# Altium project cps_tc_pishield.PrjPcb
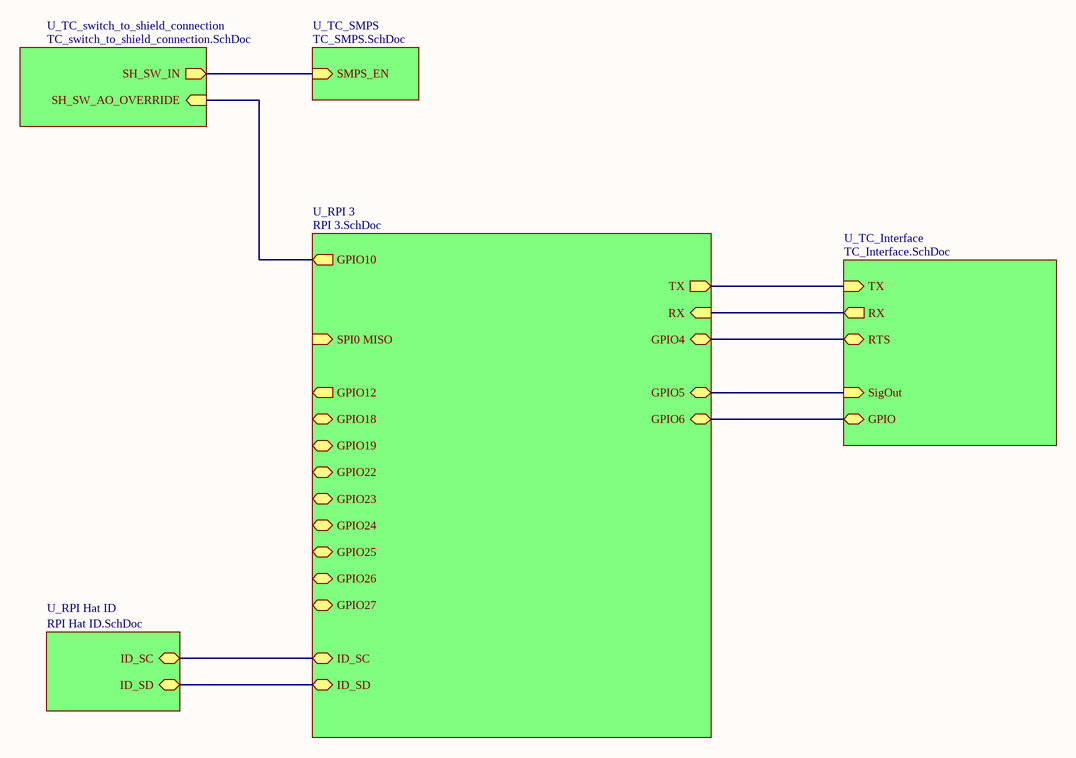
[diagram p0: cps_tc_pishield.SchDoc]
6 sheets, 32 parts. Net scope: hierarchical (ports join the sheet entries above them; power ports are global).
Board file: cps_tc_pishield.PcbDoc
Sheets:
  cps_tc_pishield.SchDoc
    U_RPI 3 = RPI 3.SchDoc
    U_RPI Hat ID = RPI Hat ID.SchDoc
    U_TC_Interface = TC_Interface.SchDoc
    U_TC_SMPS = TC_SMPS.SchDoc
    U_TC_switch_to_shield_connection = TC_switch_to_shield_connection.SchDoc

## Sheet cps_tc_pishield.SchDoc
size A4

### Sub-sheets
U_RPI 3 = RPI 3.SchDoc: GPIO4 (bidir), GPIO27 (bidir), GPIO22 (bidir), GPIO26 (bidir), GPIO19 (bidir), GPIO6 (bidir), GPIO5 (bidir), RX (in), TX (out), GPIO24 (bidir), GPIO25 (bidir), GPIO12 (out), GPIO18 (bidir), GPIO23 (bidir), ID_SC (bidir), ID_SD (bidir), SPI0 MISO (in), GPIO10 (out)
U_RPI Hat ID = RPI Hat ID.SchDoc: ID_SC (bidir), ID_SD (bidir)
U_TC_Interface = TC_Interface.SchDoc: GPIO (bidir), RTS (bidir), TX (in), RX (out), SigOut (in)
U_TC_SMPS = TC_SMPS.SchDoc: SMPS_EN (in)
U_TC_switch_to_shield_connection = TC_switch_to_shield_connection.SchDoc: SH_SW_AO_OVERRIDE (in), SH_SW_IN (out)

### Nets
EN: sheet U_TC_SMPS/SMPS_EN, sheet U_TC_switch_to_shield_connection/SH_SW_IN
GPIO0: sheet U_RPI 3/GPIO6, sheet U_TC_Interface/GPIO
RTS: sheet U_RPI 3/GPIO4, sheet U_TC_Interface/RTS
RX: sheet U_RPI 3/RX, sheet U_TC_Interface/RX
SigOut: sheet U_RPI 3/GPIO5, sheet U_TC_Interface/SigOut
TX: sheet U_RPI 3/TX, sheet U_TC_Interface/TX
NetJ3_1: sheet U_RPI 3/GPIO10, sheet U_TC_switch_to_shield_connection/SH_SW_AO_OVERRIDE
NetR4_1: sheet U_RPI 3/ID_SD, sheet U_RPI Hat ID/ID_SD
NetR5_1: sheet U_RPI 3/ID_SC, sheet U_RPI Hat ID/ID_SC

## Sheet RPI 3.SchDoc
size A4; SheetNumber: 1; SheetTotal: 1
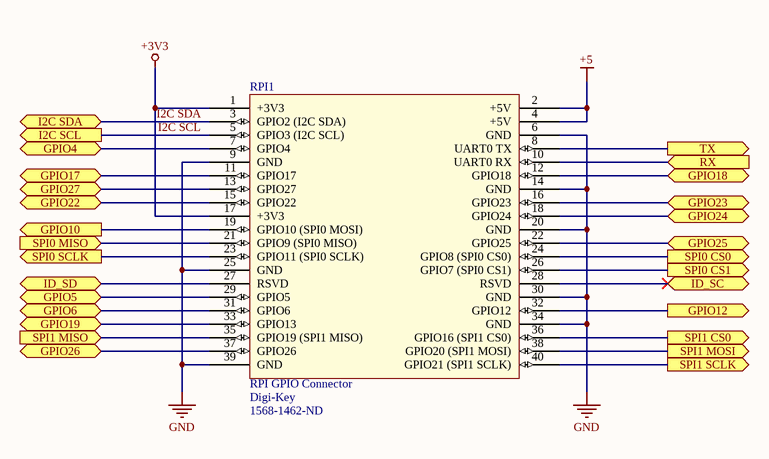
[diagram p1: RPI 3.SchDoc]

### Parts
RPI1  RPI GPIO Connector  Supplier 1: Digi-Key  Supplier Part Number 1: 1568-1462-ND  [rpi]

### Ports
GPIO4 (bidir), GPIO5 (bidir), GPIO6 (bidir), GPIO10 (out), GPIO12 (out), GPIO17 (bidir), GPIO18 (bidir), GPIO19 (bidir), GPIO22 (bidir), GPIO23 (bidir), GPIO24 (bidir), GPIO25 (bidir), GPIO26 (bidir), GPIO27 (bidir), I2C SCL (out), I2C SDA (bidir), ID_SC (bidir), ID_SD (bidir), RX (in), SPI0 CS0 (out), SPI0 CS1 (out), SPI0 MISO (in), SPI0 SCLK (out), SPI1 CS0 (out), SPI1 MISO (in), SPI1 MOSI (out), SPI1 SCLK (out), TX (out)

### Nets
+3V3: RPI1.1(+3V3) RPI1.17(+3V3)
+5: RPI1.2(+5V) RPI1.4(+5V)
GND: RPI1.6(GND) RPI1.9(GND) RPI1.14(GND) RPI1.20(GND) RPI1.25(GND) RPI1.30(GND) RPI1.34(GND) RPI1.39(GND)
GPIO0: RPI1.31(GPIO6) ; port GPIO6
I2C SCL: RPI1.5(GPIO3_(I2C_SCL)) ; port I2C SCL
I2C SDA: RPI1.3(GPIO2_(I2C_SDA)) ; port I2C SDA
RTS: RPI1.7(GPIO4) ; port GPIO4
RX: RPI1.10(UART0_RX) ; port RX
SigOut: RPI1.29(GPIO5) ; port GPIO5
TX: RPI1.8(UART0_TX) ; port TX
NetJ3_1: RPI1.19(GPIO10_(SPI0_MOSI)) ; port GPIO10
NetR4_1: RPI1.27(RSVD) ; port ID_SD
NetR5_1: RPI1.28(RSVD) ; port ID_SC
NetRPI1_11: RPI1.11(GPIO17) ; port GPIO17
NetRPI1_12: RPI1.12(GPIO18) ; port GPIO18
NetRPI1_13: RPI1.13(GPIO27) ; port GPIO27
NetRPI1_15: RPI1.15(GPIO22) ; port GPIO22
NetRPI1_16: RPI1.16(GPIO23) ; port GPIO23
NetRPI1_18: RPI1.18(GPIO24) ; port GPIO24
NetRPI1_21: RPI1.21(GPIO9_(SPI0_MISO)) ; port SPI0 MISO
NetRPI1_22: RPI1.22(GPIO25) ; port GPIO25
NetRPI1_23: RPI1.23(GPIO11_(SPI0_SCLK)) ; port SPI0 SCLK
NetRPI1_24: RPI1.24(GPIO8_(SPI0_CS0)) ; port SPI0 CS0
NetRPI1_26: RPI1.26(GPIO7_(SPI0_CS1)) ; port SPI0 CS1
NetRPI1_32: RPI1.32(GPIO12) ; port GPIO12
NetRPI1_33: RPI1.33(GPIO13) ; port GPIO19
NetRPI1_35: RPI1.35(GPIO19_(SPI1_MISO)) ; port SPI1 MISO
NetRPI1_36: RPI1.36(GPIO16_(SPI1_CS0)) ; port SPI1 CS0
NetRPI1_37: RPI1.37(GPIO26) ; port GPIO26
NetRPI1_38: RPI1.38(GPIO20_(SPI1_MOSI)) ; port SPI1 MOSI
NetRPI1_40: RPI1.40(GPIO21_(SPI1_SCLK)) ; port SPI1 SCLK

### Library data of the parts
RPI1 = rpi connector: GPIO Header for Raspberry Pi A+/B+/Pi 2/Pi 3 - 2x20; Manufacturer: SparkFun Electronics; Manufacturer Part Number: PRT-14017; Nils Minor: author; nilsminor@web.de: mail; RoHS: RoHS Compliant; Category: Development Boards, Kits, Programmers; Stock 1: 150; Pricing 1: 1=1.84 (EUR); Part Status: Active; Accessory Type: Connector; For Use With/Related Products: Raspberry Pi; ComponentLink1URL: https://cdn.sparkfun.com/datasheets/Dev/RaspberryPi/12313.pdf; ComponentLink1Description: https://cdn.sparkfun.com/datasheets/Dev/RaspberryPi/12313.pdf

## Sheet RPI Hat ID.SchDoc
size A4
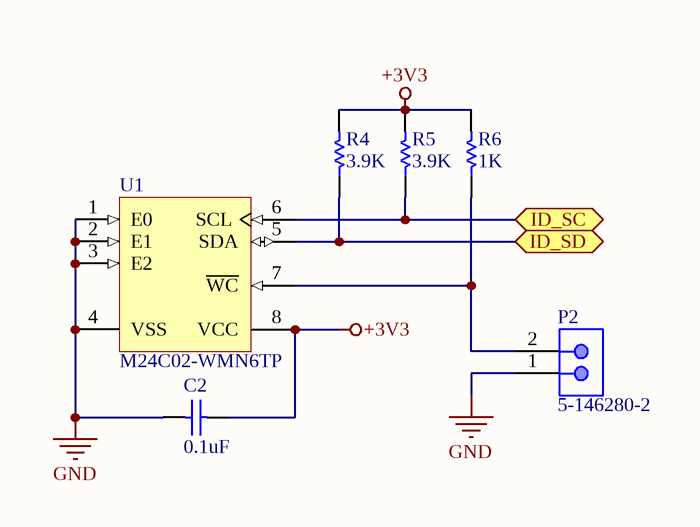
[diagram p2: RPI Hat ID.SchDoc]

### Parts
C2  0.1uF  [CAPC1608X87X35NL15T15]
P2  5-146280-2  [TECO-5-146280-2_V]
R4  3.9K  [RESC1608X55X30ML15T15]
R5  3.9K  [RESC1608X55X30ML15T15]
R6  1K  [RESC1608X55X30ML15T15]
U1  M24C02-WMN6TP  [STM-M24C02-WMN6TP-8_M]

### Ports
ID_SC (bidir), ID_SD (bidir)

### Nets
+3V3: C2.1 R4.2 R5.2 R6.2 U1.8(VCC)
GND: C2.2 P2.1 U1.1(E0) U1.2(E1) U1.3(E2) U1.4(VSS)
NetP2_2: P2.2 R6.1 U1.7(~{WC})
NetR4_1: R4.1 U1.5(SDA) ; port ID_SD
NetR5_1: R5.1 U1.6(SCL) ; port ID_SC

### Library data of the parts
C2 = CMP-2006-03300-1: Part Number: C0603X104K5RACTU; Manufacturer: Kemet
P2 = CMP-2000-07492-1: Male Header, Pitch 2.54 mm, 1 x 2 Position, Height 8.21 mm, Tail Length 3.05 mm, -65 to 105 degC, RoHS, Bulk; Manufacturer: TE Connectivity; Mating Connector Lock: No(Without); Number of Positions: 2; Pitch: 2.54mm; PCB Mounting Orientation: Vertical; Keyed: No; Case\/Package: 100; Mating Post Length: 0.23inch; High Temperature Housing: Yes; Max Current Rating: 5A; PCB Thickness: 0.063inch; PCB Mount Retention: Without; Approvals: CSA; Current Rating: 3A; Radiation Hardening: No; Length: 4.67mm; Contact Mating Length: 0.23inch; Connector Type: Header; Number of Rows: 1; Termination Post Length: 0.12inch; Board Standoff: No(Without); Max Operating Temperature: 105degC; Contact Shape: Square; Selectively Loaded: No(Without); Gasket: No(Without); Number of Contacts: 2; Contact Gender: Male; Mating Alignment: No(Without); Manufacturer URL: http://www.te.com/; Datasheet URL: http://www.te.com/commerce/DocumentDelivery/DDEController?Action=showdoc&DocId=Customer+Drawing%7F146280%7FH1%7Fpdf%7FEnglish%7FENG_CD_146280_H1.pdf%7F5-146280-2; Mount: ThroughHole; Orientation: Straight; Packaging: Carton; Package Reference: 5-146280-2; Package Quantity: 500; Stabilizers: No(Without); Row Spacing: 2.54mm; Contact Material: CopperAlloy; Panel Mount Retention: No(Without); Datasheet Version: Rev. H1, 08/2016; Housing Colour: Black; Colour: Black; Package Description: Male Header, Pitch 2.54 mm, 1 x 2 Position, Height 8.21 mm, Tail Length 3.05 mm; Contact Plating: Matte; Housing Material: Polymer; Contact Protection: No(Without); Min Operating Temperature: -65degC; Mounting Technology: ThroughHole; Flammability Rating: UL94V-0; RoHSCompliant: true; Termination: ThroughHole; Depth: 2.34mm; High Speed Serial Data Connector: No
R4-R6 = CMP-2000-00180-1: Part Number: ERJ-3EKF1001V; Manufacturer: Panasonic
U1 = CMP-2000-05370-1: EEPROM Serial-I2C, 2Kbit, 2.5 to 5.5 V, 400 kHz, 8-Pin SO, -40 to 85 degC, RoHS, Tape and Reel; Manufacturer: STMicroelectronics; Supply Current: 2mA; Frequency: 0.4MHz; Data Retention: 40; Density: 2048Bit; Rad Hardened: No; Write Protection: Yes; Interface Type: Serial(I2C); DELETED: Compliant; Access Time (Max): 900ns; Operating Supply Voltage (Typ): 3.3/5V; Operating Supply Voltage (Max): 5.5V; Organization: 256x8; Operating Supply Voltage (Min): 2.5V; Operating Temperature (Max): 85C; Operating Temperature Classification: Industrial; Operating Temp Range: -40Cto85C; Frequency (Max): 0.4MHz; Datasheet URL: https://datasheet.ciiva.com/26870/m24c02-wmn6tp-26870257.pdf; Package Type: SOICN; Operating Temperature (Min): -40C; Programmable: Yes; Manufacturer URL: http://www.st.com/; Pin Count: 8; Packaging: TapeandReel; Mounting: SurfaceMount; Datasheet Version: Rev. 17, 04/2011

## Sheet TC_Interface.SchDoc
size A4
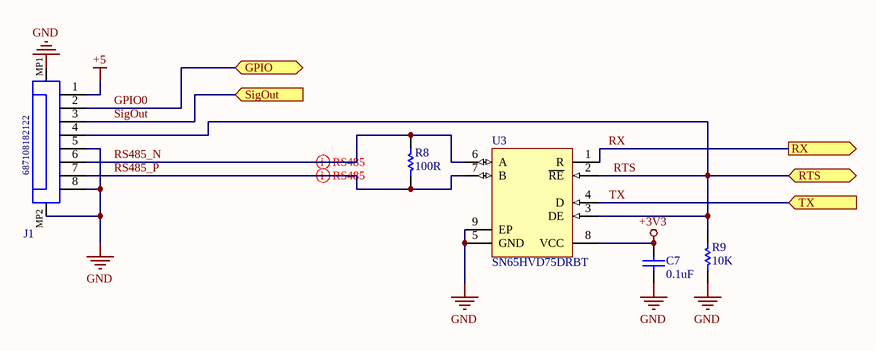
[diagram p3: TC_Interface.SchDoc]

### Parts
C7  0.1uF  [CAPC1608X95X40NL15T15]
J1  687108182122  [687108182122]
R8  100R  [RESC0603(1608)_N]
R9  10K  [RESC0603(1608)_N]
U3  SN65HVD75DRBT  [DRB0008B_V]

### Ports
GPIO (bidir), RTS (bidir), RX (out), SigOut (in), TX (in)

### Nets
+3V3: C7.2 U3.8(VCC)
+5: J1.1
GND: C7.1 J1.5 J1.8 J1.MP1 J1.MP2 R9.2 U3.5(GND) U3.9(EP)
GPIO0: J1.2 ; port GPIO
RS485_N: J1.6 R8.1 U3.6(A)
RS485_P: J1.7 R8.2 U3.7(B)
RTS: J1.4 R9.1 U3.2(~{RE}) U3.3(DE) ; port RTS
RX: U3.1(R) ; port RX
SigOut: J1.3 ; port SigOut
TX: U3.4(D) ; port TX

### Layout directives
differential pair; differential pair class *: RS485_N, RS485_P

### Library data of the parts
C7 = CMP-2006-01884-1: Part Number: VJ0603Y104JXQCW1BC; Manufacturer: Vitramon
J1 = CMP-1502-01646-1: SMT ZIF Connectors WR-FPC, Horizontal, Back Locking Dual Contact, pitch 0.5 mm, 8 pins; Manufacturer: Wurth Elektronik; Contact Resistance: 30mOhm; Working Voltage: 50VAC; Withstanding Voltage: 250VAC; Pin Number: 8; Rated Current: 0.5A; Pitch: 0.5mm; Manufacturer URL: http://www.we-online.de; Mounting Technology: SMT; Contact Design: BackLockingDualContact; Part Number: 687108182122; Package Reference: 687108182122; Orientation: Horizontal; Operating Temperature: -55to85degC; Datasheet URL: https://katalog.we-online.de/em/datasheet/687108182122.pdf; Publisher: WurthElektronik; Packaging: TapeandReel
R8 R9 = CMP-1012-00623-1: 10K 0.1W 1% 0603 (1608 Metric)  SMD; Value: 10000.00 Ohm; Case-EIA: 0603; Case-Metric: 1608; Power: 0.1 W; Tolerance: 1 %; Technology: SMT
U3 = CMP-0694-00015-2: 3.3 V Supply RS-485 with IEC ESD Protection, 20 Mbps, -40 to 125 degC, 8-Pin SON, RoHS, Tape and Reel; Manufacturer: Texas Instruments; VI: -7 to 12 V; ESD: 15 kV; VCC: 3 to 3.6 V; ICC (Max) (mA): 0.95; Signaling Rate (Max) (Mbps): 20; No. of TX: 1; Packing: Tape and Reel; ComponentLink3Description: Package Specification; RoHS: TRUE; PartNumber: SN65HVD75DRBT; ComponentLink2URL: http://www.ti.com/lit/ds/sllse11c/sllse11c.pdf; ComponentLink2Description: Datasheet; ComponentLink3URL: http://www.ti.com/lit/ds/sllse11c/sllse11c.pdf; PackageVersion: 4203482-2/K; DatasheetVersion: SLLSE11C; PackageReference: DRB0008B; PackageDescription: 8-Pin Plastic Small Outline No-Lead, Body 3 x 3 mm, Pitch 0.65 mm; ComponentLink1Description: Manufacturer URL; Operating Temperature Range: -40 to 125 degC; No. of RX: 1; Mounting Technology: Surface Mount; ComponentLink1URL: http://www.ti.com/

## Sheet TC_SMPS.SchDoc
size A4
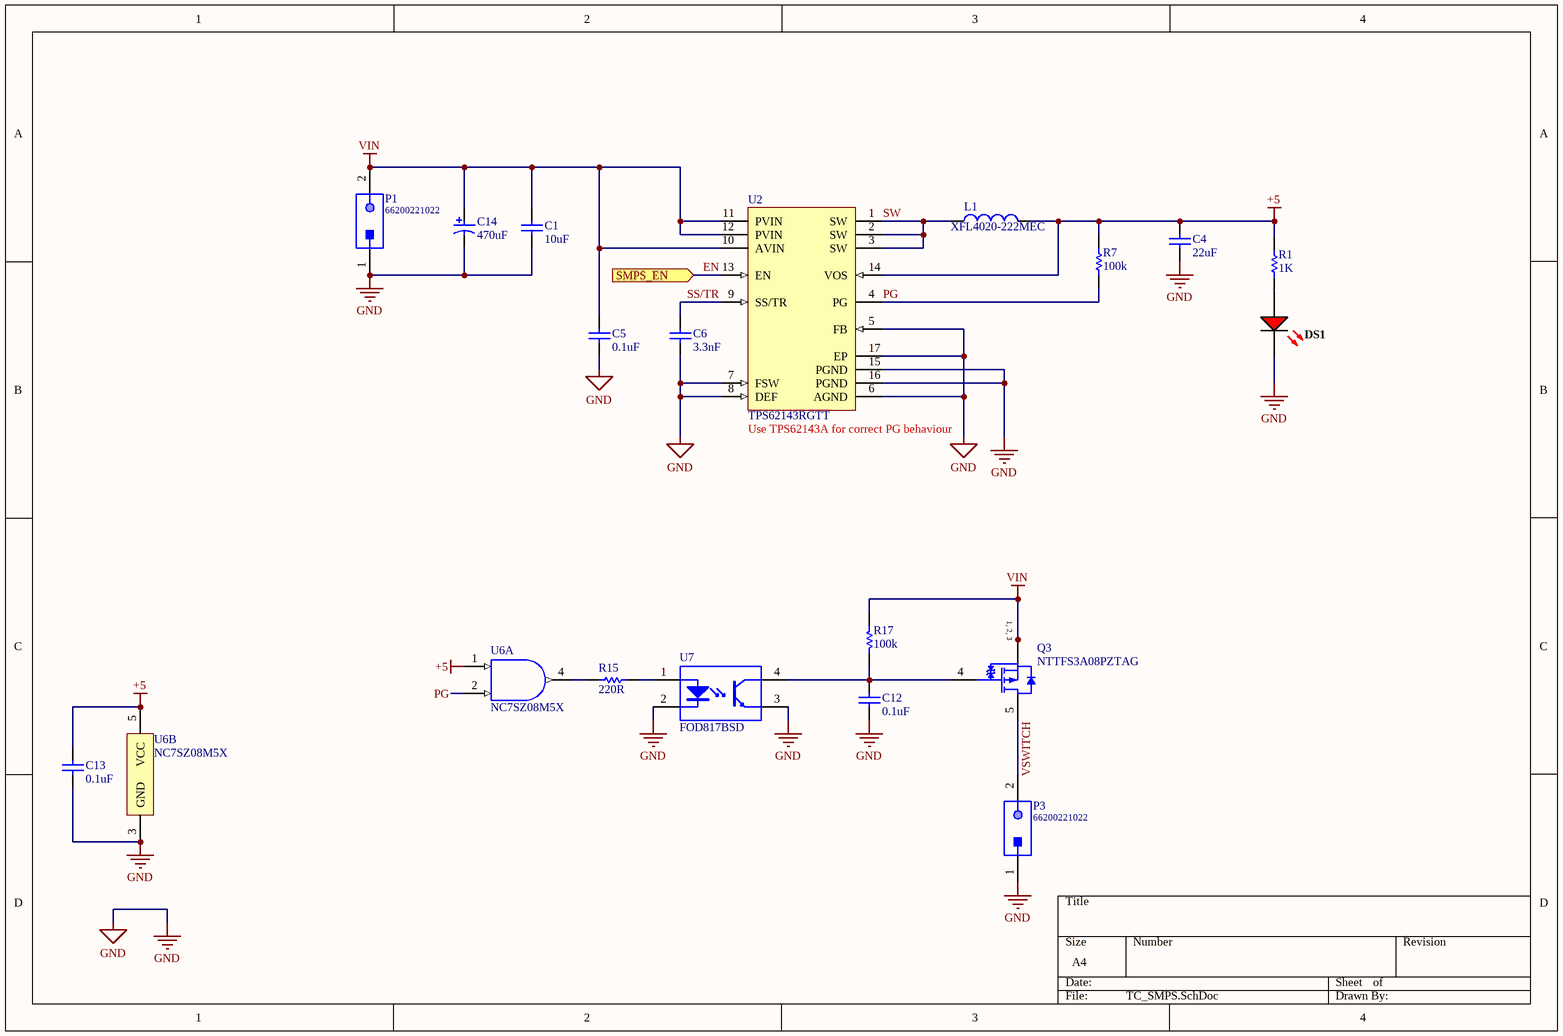
[diagram p4: TC_SMPS.SchDoc]

### Parts
C1  10uF  [CAPC1210(3225)210_M]
C4  22uF  [CAPC2013X95X45ML15T25]
C5  0.1uF  [CAPC1608X87X35NL15T15]
C6  3.3nF  [CAPC1608X87X35NL15T15]
C12  0.1uF  [CAPC1608X87X35NL15T15]
C13  0.1uF  [CAPC1608X87X35NL15T15]
C14  470uF  [PNSC-FK-V-F_V]
DS1  APG1608SURKC/T  [KING-LED0603-25-RED_V]  (value not drawn)
L1  XFL4020-222MEC  [COIL-IND-2_V]
P1  66200221022  [66200221022]
P3  66200221022  [66200221022]
Q3  NTTFS3A08PZTAG  [ONSC-WDFN-8-511AB_V]
R1  1K  [RESC1608X55X30LL15T15]
R7  100k  [RESC1608X55X25ML10T15]
R15  220R  [RESC1609X50X30LL10T20]
R17  100k  [RESC1608X55X25ML10T15]
U2  TPS62143RGTT  [RGT0016C_V]
U6  NC7SZ08M5X  [FAIR-SOT23-5_V]  (parts A,B of 2)
U7  FOD817BSD  [FAIR-MDIP-4_V]

### Ports
SMPS_EN (in)

### Nets
+5: C4.2 C13.1 L1.2 R1.2 R7.2 U2.14(VOS) U6.1(A) U6.5(VCC)
GND: C1.1 C4.1 C5.2 C6.1 C12.2 C13.2 C14.2 DS1.2(K) P1.1 P3.1 U2.5(FB) U2.6(AGND) U2.7(FSW) U2.8(DEF) U2.15(PGND) U2.16(PGND) U2.17(EP) U6.3(GND) U7.2(CATHODE) U7.3(EMITTER)
VIN: C1.2 C5.1 C14.1 P1.2 Q3.1(S) Q3.2(S) Q3.3(S) R17.2 U2.10(AVIN) U2.11(PVIN) U2.12(PVIN)
EN: U2.13(EN) ; port SMPS_EN
PG: R7.1 U2.4(PG) U6.2(B)
SS/TR: C6.2 U2.9(SS/TR)
SW: L1.1 U2.1(SW) U2.2(SW) U2.3(SW)
VSWITCH: P3.2 Q3.5(D)
NetC12_1: C12.1 Q3.4(G) R17.1 U7.4(COLLECTOR)
NetDS1_1: DS1.1(A) R1.1
NetR15_1: R15.1 U6.4(Y)
NetR15_2: R15.2 U7.1(ANODE)

### Notes on the sheet
- (near U2) Use TPS62143A for correct PG behaviour
- (in symbol CMP-1058-01043-1) 1, 2, 3

### Library data of the parts
C1 = CMP-1038-02235-1: CAP 10uF 35V ±20% 1210 (3225 Metric) Thickness 2.1mm SMD; Tolerance: Â±20%; Case-Metric: 3225; Case-EIA: 1210; Technology: SMT; Rated Voltage: 35 V; Value: 10uF; Max Thickness: 2.1 mm
C4 = CMP-2007-00096-1: Manufacturer: Murata; Part Number: GRM219R61A226MEA0D
C5 C12 C13 = CMP-2006-03300-1: as C2 on sheet RPI Hat ID
C6 = CMP-2006-03881-1: Part Number: C0603C332K5RAC7867; Manufacturer: Kemet
C14 = CMP-2000-06204-1: Aluminum Electrolytic Capacitor, 470 uF, +/- 20%, 16 V, 2-Pin SMD (Size Code F), -55 to 105 degC, RoHS, Tape and Reel; Manufacturer: Panasonic; Capacitance: 470µF; Type: Can; Ripple Current: 600mA; Lifetime@Temperature: 2000Hrs@105°C; Impedance: 0.16O; Rated Voltage: 16V; Manufacturer URL: http://www.panasonic.com/; Package Description: 2-Pin Electrolytic Aluminum Capacitor, Body 8.3 x 8.3 mm; Operating Temp-Max: 105°C; Mounting Technology: SurfaceMount; Operating Temp Range: -55to+105°C; Datasheet Version: 03/2016; Series: FK; Package Reference: FK-V-F; Case Size/Dimension: Ø8x10.2mm; Package URL: http://industrial.panasonic.com/cdbs/www-data/pdf/RDE0000/DME0000COL48.pdf; Datasheet URL: http://industrial.panasonic.com/cdbs/www-data/pdf/RDE0000/ABA0000C1181.pdf
DS1 = CMP-0404-00004-1: Ultra Thin Hyper Red SMD Chip LED Lamp, 2 to 2.5 V, -40 to 85 degC, Body 1.6 x 0.8 mm, 0.28 mm Thickness, RoHS, Tape and Reel; Manufacturer: Kingbright; Dice: Hyper Red (AlGaInP); IR (Max): 10 uA; Luminous Intensity mcd @ 20 mA (Min.): 55; Lens Type: Water Clear; Viewing Angle: 120; Luminous Intensity mcd @ 20 mA (Typ.): 110; ComponentLink2Description: Datasheet; ComponentLink3URL: http://www.kingbrightusa.com/images/catalog/SPEC/APG1608SURKC-T.pdf; Packing: Tape and Reel; Mounting Technology: Surface Mount; PackageVersion: Rev. V.5A; ComponentLink1Description: Manufacturer URL; ComponentLink2URL: http://www.kingbrightusa.com/images/catalog/SPEC/APG1608SURKC-T.pdf; ComponentLink3Description: Package Specification; PackageDescription: 2-Pin SMT, Body 1.6 x 0.8 mm, 0.28mm Thickness, Red; PackageReference: LED0603-25-RED; DatasheetVersion: Rev. V.5A; Operating Temperature: -40 to 85 degC; PartNumber: APG1608SURKC/T; ComponentLink1URL: http://www.kingbrightusa.com/; Forward Voltage: 2 to 2.5 V; RoHS: TRUE
L1 = CMP-2000-05090-2: High Temperature Shielded Power Inductor, 2.2 uH, +/- 20 %, -40 to 125 degC, 2-Pin SMD, RoHS, Tape and Reel; Manufacturer: Coilcraft; Case Length: 4.3mm; Case Height: 2.1mm; Tolerance: 20%; Self Resonant Frequency: 38MHz; Inductance: 2.2uH; Maximum DC Resistance: 23.5mOhms; Test Frequency: 100kHz; Core Material: Composite; Maximum DC Current: 8A; Case Width: 4.3mm; Series: XFL4020; RoHS: Details; Termination Style: SMD/SMT; PartNumber: XFL4020-222MEC; Datasheet Version: Jul-12; Shielding: Shielded; Datasheet URL: http://www.mouser.com/ds/2/597/xfl4020-270756.pdf; Dimensions: 4.3mmWx4.3mmLx2.1mmH; Operating Temperature Range: -40Cto+125C; Packaging: Reel; Product: PowerInductors; Manufacturer URL: http://www.coilcraft.com/
P1 P3 = CMP-1502-00364-1: THT Male Header WR-MPC3, with Snap-in Plastic Pegs, Right Angled, Dual Row, pitch 3 mm, 2 pins; Manufacturer: Wurth Elektronik; Pitch: 3mm; Pin Number: 2; Working Voltage: 250VAC; Contact Resistance: 10mOhm; Part Number: 66200221022; Manufacturer URL: http://www.we-online.de; Mounting Technology: THT; Datasheet URL: https://katalog.we-online.de/em/datasheet/6620xx21022.pdf; Package Reference: 66200221022; Packaging: Tube; Orientation: RightAngled; Operating Temperature: -40to105degC; Gender: Male; Publisher: WurthElektronik
Q3 = CMP-1058-01043-1: Power MOSFET, -20 V, -15 A, Single P-Channel, 8-Pin WDFN, Pb-Free, Tape and Reel; Manufacturer: On Semiconductor; ID Max (A): 15; V(BR)DSS Min (V): 20; Coss Typ (pF): 600; Ciss Typ (pF): 5000; Qrr Typ (nC): 234; Crss Typ (pF): 540; Channel Polarity: P Channel; VGS(th) Max (V): 1; VGS Max (V): 8; ComponentLink2URL: http://www.onsemi.cn/pub_link/Collateral/NTTFS3A08PZ-D.PDF; ComponentLink1URL: http://www.onsemi.com/; ComponentLink2Description: Datasheet; Package Type: u8FL / WDFN-8; DatasheetVersion: Rev. 2; ComponentLink3URL: http://www.onsemi.com/pub_link/Collateral/511AB.PDF; Configuration: Single; RoHS: Pb-Free; ComponentLink3Description: Package Specification; PartNumber: NTTFS3A08PZTAG; PackageDescription: 8-Pin Small Outline No-Lead, Body 3.05 x 3.05 mm, Pitch 0.65 mm; Packing: Tape and Reel; PackageVersion: Rev. D, 04/2012; ComponentLink1Description: Manufacturer URL; PackageReference: WDFN-8-511AB; Mounting Technology: Surface Mount
R1 = CMP-2000-00180-1: as R4 on sheet RPI Hat ID
R7 R17 = CMP-2100-03662-1: Chip Resistor, 100 KOhm, +/- 1%, 0.1 W, -55 to 155 degC, 0603 (1608 Metric), RoHS, Tape and Reel; Manufacturer: Yageo; Power Rating: 100mW; Voltage Rating: 50V; Temperature Coefficient: 100ppm/degreesC; Datasheet Version: Rev. 5, 10/2016; Height: 0.45mm; Lead Free: LeadFree; Manufacturer URL: http://www.yageo.com/; Package Reference: 0603; Depth: 0.8mm; RoHSCompliant: true; Composition: ThickFilm; Military Standard: Not; Resistance: 100KOhm; Case/Package: 0603; Packaging: TapeandReel; Case Code (Imperial): 0603; Voltage Rating (DC): 50V; Case Code (Metric): 1608; Tolerance: 1%; Termination: SMD/SMT; Min Operating Temperature: -55degC; Number of Pins: 2; Length: 1.6mm; Width: 0.8mm; Datasheet URL: http://www.yageo.com/NewPortal/yageodocoutput?fileName=/pdf/R-Chip/PYu-RC_Group_51_RoHS_L_5.pdf; Package Description: 2-Pin Surface Mount Device, Body 1.6 x 0.8 mm; Max Operating Temperature: 155degC; REACH SVHC: NoSVHC
R15 = CMP-2000-03085-1: Part Number: CRCW0603220RFKEA; Manufacturer: Vishay Dale
U2 = CMP-0323-00125-3: Buck Step Down Regulator with 3 to 17 V Input and 5 V Output, -40 to 85 degC, 16-Pin QFN (RGT), Green (RoHS & no Sb/Br); Manufacturer: Texas Instruments; Vin(Max)(V): 17; Synchronous Rectification: TRUE; Vout(Min)(V): 5; Vin(Min)(V): 3; Duty Cycle(Max)(%): 100; Iout(Max)(A): 2; Regulated Outputs(#): 1; Iq(Typ)(mA): 0.017; Rating: Catalog; SubFamily: Step-Down Regulator; ComponentLink2Description: Package Specification; PackageVersion: revH, Oct-2011; ComponentLink1Description: Datasheet; ComponentLink3Description: URL Link1; Code_JEDEC: MO-220; Mounting Technology: Surface Mount; PartNumber: TPS62143RGTT; Vout(Max)(V): 5; Topology: Buck; ComponentLink1URL: http://www.ti.com/general/docs/lit/getliterature.tsp?genericPartNumber=TPS62143&fileType=pdf; Eco-Plan: Green (RoHS & no Sb/Br); Preset Vout(V): 5; PackageReference: RGT0016C; Switch Current Limit(Typ)(A): 3; ComponentLink2URL: http://www.ti.com/litv/pdf/mpqf119g; DatasheetVersion: SLVSAJ0; ComponentLink3URL: Samples URL:http://www.ti.com/product/tps54611#samples; PackageDescription: 16-Pin Plastic Quad Flat No-Lead, 3 x 3 mm Body, 0.5 mm Pitch, 1.7 x 1.7 mm Exposed Pad
U6 = CMP-2000-06815-1: TinyLogic(R) UHS 2-Input AND Gate, 1.65 to 5.5 V, -40 to 85 degC, 5-Pin SOT23, RoHS, Tape and Reel; Manufacturer: FairchildSemiconductor; Logic Family: NC7SV; Package Version: 08/2015; Low Level Output Current: 32mA; Number of Gates: 1Gate; Number of Input Lines: 2Input; Propagation Delay Time: 5.2ns; Unit Weight: 0.001058oz; High Level Output Current: -32mA; Supply Voltage - Min: 1.65V; Supply Voltage - Max: 5.5V; Number of Output Lines: 1Output; Maximum Operating Temperature: +85C; Package Reference: SOT23-5; Package URL: https://www.fairchildsemi.com/package-drawings/MA/MA05B.pdf; Package Description: 5-Pin Small Outline Transistor, Body 2.9 x 1.6 mm, Pitch 0.95 mm; Datasheet URL: https://www.fairchildsemi.com/datasheets/NC/NC7SZ08.pdf; Manufacturer URL: https://www.fairchildsemi.com/; Product Category: LogicGates; Series: TinyLogic; Mounting Technology: SurfaceMount; RoHS: True; Packaging: Reel; Mounting Style: SMD/SMT; Logic Type: 2-InputAND; Minimum Operating Temperature: -40C; <PCN>: http://www.mouser.com/PCN/3.26.10LTBDFairchild.pdf; Brand: FairchildSemiconductor; Product: Single-FunctionGate; Package / Case: SOT-23; Datasheet Version: Rev. 1.0.3, 09/2009; Logic Function: AND
U7 = CMP-2000-06280-1: Phototransistor Optocoupler, 4 us Rise, 3 us Fall, 5000 Vrms, -55 to 110 degC, 4-Pin MDIP, RoHS, Tape and Reel; Manufacturer: Fairchild Semiconductor; Input Type: DC; Maximum Collector Current: 50mA; Product Width: 7mm(Max); Minimum Current Transfer Ratio: 130%; Typical Forward Voltage: 1.2V; Maximum Power Dissipation: 200mW; Maximum Collector Emitter Voltage: 70V; Maximum Rise Time: 18us; Package Version: 10/2014; Typical Fall Time: 3us; Pin_Count: 4; Maximum Forward Voltage: 1.4V; Maximum Current Transfer Ratio: 260%; Maximum Collector Emitter Saturation Voltage: 200mV; Maximum Reverse Voltage: 6V; Number of Channels per Chip: 1; Typical Rise Time: 4us; Product Height: 4mm(Max); Product Length: 5.1mm(Max); Maximum Input Current: 50mA; Family: FOD817; Output Device: Transistor; Maximum Operating Temperature: 110C; Package URL: https://www.fairchildsemi.com/package-drawings/N0/N04C.pdf; Supplier_Package: PDIPSMDBlack; Minimum Isolation Voltage: 5000Vrms; Mounting Technology: SurfaceMount; Product Type: TransistorandPhotovoltaicOutputPhotoCouplers; Packaging: TapeandReel; Package Reference: MDIP 4L; Output Type: DC; Mounting: SurfaceMount; Package Description: 4-Pin Surface Mount Device, Body 6.5 x 4.6 mm, Pitch 2.54 mm; Maximum Fall Time: 18us; Datasheet URL: https://www.fairchildsemi.com/datasheets/FO/FOD817B.pdf; Datasheet Version: Rev. 2.8, 11/2015; Minimum Operating Temperature: -55C; Manufacturer URL: https://www.fairchildsemi.com/

## Sheet TC_switch_to_shield_connection.SchDoc
size A4
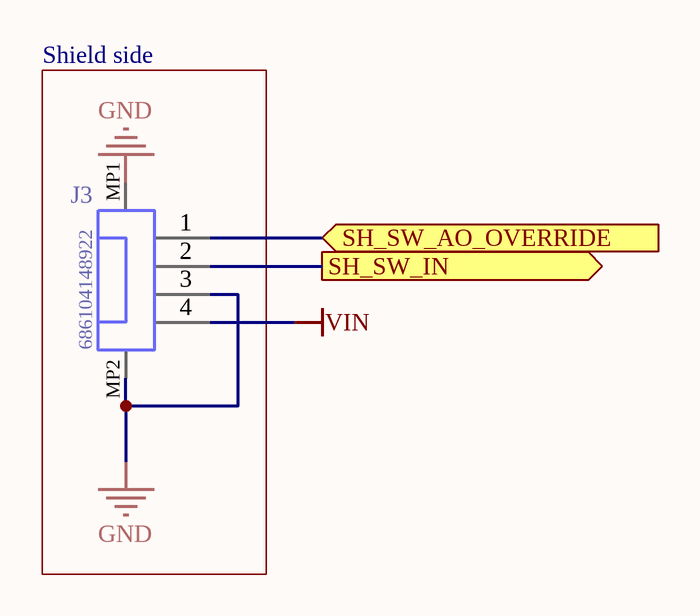
[diagram p5: TC_switch_to_shield_connection.SchDoc]

### Parts
J3  686104148922  [686104148922]

### Blocks framed on the sheet
Shield side: J3

### Ports
SH_SW_AO_OVERRIDE (in), SH_SW_IN (out)

### Nets
GND: J3.3 J3.MP1 J3.MP2
VIN: J3.4
EN: J3.2 ; port SH_SW_IN
NetJ3_1: J3.1 ; port SH_SW_AO_OVERRIDE

### Library data of the parts
J3 = CMP-1502-01512-1: SMT ZIF Connectors Hinge Type WR-FPC, Horizontal, Bottom Contact, pitch 1 mm, 4 pins; Manufacturer: Wurth Elektronik; Contact Resistance: 50mOhm; Withstanding Voltage: 500VAC; Working Voltage: 100VAC; Pitch: 1mm; Rated Current: 1A; Pin Number: 4; Operating Temperature: -40to105degC; Part Number: 686104148922; Packaging: TapeandReel; Package Reference: 686104148922; Datasheet URL: https://katalog.we-online.de/em/datasheet/686104148922.pdf; Mounting Technology: SMT; Manufacturer URL: http://www.we-online.de; Contact Design: BottomContact; Orientation: Horizontal; Publisher: WurthElektronik

## Nets that join several sheets
+3V3: RPI 3 (RPI1.1 RPI1.17), RPI Hat ID (5 pins), TC_Interface (C7.2 U3.8)
+5: RPI 3 (RPI1.2 RPI1.4), TC_Interface (J1.1), TC_SMPS (8 pins)
GND: RPI 3 (8 pins), RPI Hat ID (6 pins), TC_Interface (8 pins), TC_SMPS (20 pins), TC_switch_to_shield_connection (J3.3 J3.MP1 J3.MP2)
VIN: TC_SMPS (11 pins), TC_switch_to_shield_connection (J3.4)
EN: TC_SMPS (U2.13), TC_switch_to_shield_connection (J3.2)
GPIO0: RPI 3 (RPI1.31), TC_Interface (J1.2)
NetJ3_1: RPI 3 (RPI1.19), TC_switch_to_shield_connection (J3.1)
NetR4_1: RPI 3 (RPI1.27), RPI Hat ID (R4.1 U1.5)
NetR5_1: RPI 3 (RPI1.28), RPI Hat ID (R5.1 U1.6)
RTS: RPI 3 (RPI1.7), TC_Interface (J1.4 R9.1 U3.2 U3.3)
RX: RPI 3 (RPI1.10), TC_Interface (U3.1)
SigOut: RPI 3 (RPI1.29), TC_Interface (J1.3)
TX: RPI 3 (RPI1.8), TC_Interface (U3.4)